# Altium schematic sheet Status_LED.SchDoc
size A; SheetNumber: 3; SheetTotal: 5
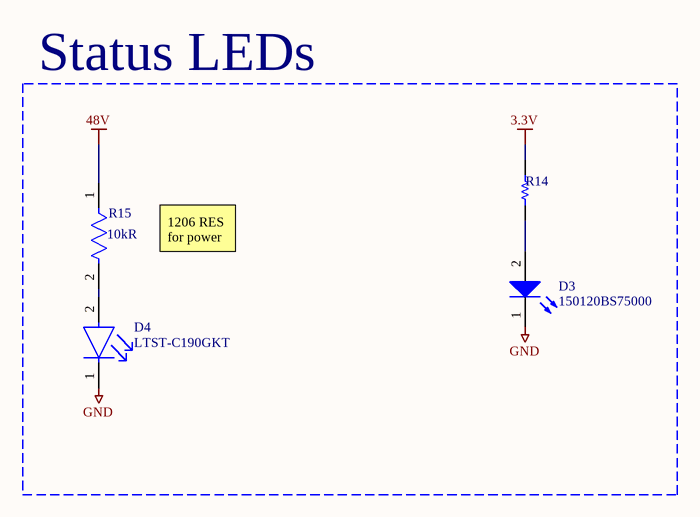
[diagram p0: Status_LED.SchDoc]

## Parts
D3  150120BS75000  [WL-SMCW_1206_150120xx75000]
D4  LTST-C190GKT  [FP-LTST-C190GKT-MFG]
R14  ERA3AEB301V  [RESC1608X55X30LL20T20]  (value not drawn)
R15  Resistance: 10kR  [FP-RK73H2B-IPC_C]  (hidden comment: RK73H2BTTDD1002F)

## Blocks framed on the sheet
Status LEDs: D3 D4 R14 R15

## Nets
3.3V: R14.1
48V: R15.1
GND: D3.1(K) D4.1(C)
NetD3_2: D3.2(A) R14.2
NetD4_2: D4.2(A) R15.2

## Notes on the sheet
- 1206 RES for power

## Library data of the parts
D3 = CMP-1426-00015-3: WL-SMCW SMT Mono-Color Chip LED Waterclear; Manufacturer Package Identifier: LED_1206; Dominant Wavelength: 470nm; Lens Style: Clear, Rectangular; Test Current: 20mA; Forward Voltage: 3.2V; Forward Current: 100mA; Peak Wavelength: 465nm; Max Reverse Voltage (DC): 5V; Viewing Angle: 140°; Color: Blue; Luminous Intensity: 145mcd; Max Operating Temperature: 85°C; Case Code (Imperial): 1206; Length: 3.2mm; Width: 1.6mm; Min Operating Temperature: -40°C; Height: 680µm; Case Code (Metric): 3216; Packaging: Tape and Reel; RoHS: Compliant; Case/Package: 1206; REACH SVHC: Unknown; Wavelength: 470nm; Mount: Surface Mount
D4 = CMP-22017-000005-2: LED GREEN CLEAR CHIP SMD; Dominant Wavelength: 569nm; Reverse Voltage: 5V; Lens Color: Colorless; Viewing Angle: 130°; Voltage: 2V; Forward Current: 30mA; Power Dissipation: 100mW; Luminous Intensity: 6mcd; Number of LEDs: 1; Forward Voltage: 2.1V; Wavelength: 565nm; Test Current: 10mA; Min Operating Temperature: -55°C; Lens Style: Clear; Mount: Surface Mount; Width: 0.8mm; Packaging: Tape and Reel; Lens Transparency: Clear; Case Code (Metric): 1608; Depth: 0.8mm; Case Code (Imperial): 0603; Case/Package: 0603; Number of Pins: 2; Max Operating Temperature: 85°C; Lead Free: Lead Free; Number of Elements: 1; Length: 1.6mm; Height: 0.8mm; Package Quantity: 1; Power Rating: 100mW; Radiation Hardening: No; Illumination Color: Green; Color: Green
R14 = CMP-2000-00025-1: Manufacturer: Panasonic; Part Number: ERA3AEB301V
R15 = CMP-2003-01644-2: 10kΩ ±1% 0.25W Chip Resistor 1206 Thick Film AEC-Q200 Qualified; Voltage Rating: 200V; Temperature Coefficient: 100ppm/°C; Power Rating: 250mW; Max Operating Temperature: 155°C; Min Operating Temperature: -55°C; Case/Package: Molded; Case Code (Imperial): 1206; RoHS Compliant: Yes; Packaging: Tape and Reel; Series: RK73H; Lead Free: Lead Free; Voltage Rating (DC): 200V; Tolerance: 1%; Termination: SMD/SMT; Case Code (Metric): 3216